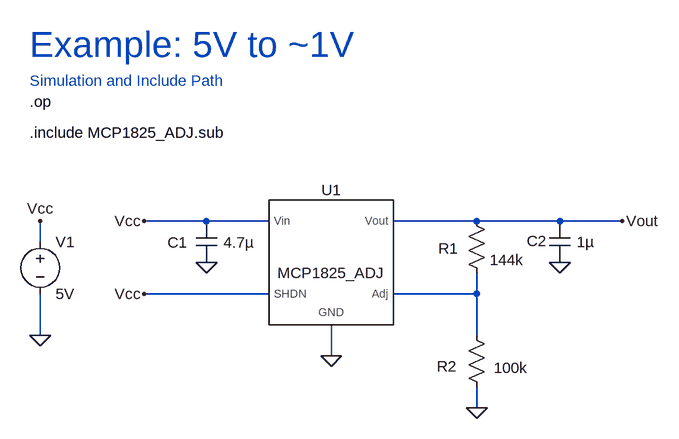
[diagram p0: schematic MCP1825_ADJ.asc]
MCP1825_ADJ.asc, the LTspice schematic file:
Version 4
SHEET 1 880 680
WIRE 48 64 -48 64
WIRE 144 64 48 64
WIRE 464 64 336 64
WIRE 592 64 464 64
WIRE 688 64 592 64
WIRE -208 96 -208 64
WIRE 144 176 -48 176
WIRE 464 176 464 144
WIRE 464 176 336 176
WIRE -208 240 -208 176
WIRE 464 240 464 176
WIRE 240 272 240 224
WIRE 464 352 464 320
FLAG -208 240 0
FLAG -208 64 Vcc
FLAG -48 64 Vcc
FLAG 48 128 0
FLAG -48 176 Vcc
FLAG 240 272 0
FLAG 464 352 0
FLAG 592 128 0
FLAG 688 64 Vout
SYMBOL PowerProducts\\MCP1825 240 176 R0
SYMATTR InstName U1
SYMBOL voltage -208 80 R0
SYMATTR InstName V1
SYMATTR Value 5V
SYMBOL cap 32 64 R0
WINDOW 0 -44 33 Left 2
WINDOW 3 42 33 Left 2
SYMATTR InstName C1
SYMATTR Value 4.7µ
SYMBOL res 448 224 R0
WINDOW 0 -45 64 Left 2
WINDOW 3 42 66 Left 2
SYMATTR InstName R2
SYMATTR Value 100k
SYMBOL res 448 48 R0
WINDOW 0 -43 58 Left 2
SYMATTR InstName R1
SYMATTR Value 144k
SYMBOL cap 576 64 R0
WINDOW 0 -35 31 Left 2
WINDOW 3 42 32 Left 2
SYMATTR InstName C2
SYMATTR Value 1µ
TEXT -224 -120 Left 2 !.op
TEXT -224 -72 Left 2 !.include MCP1825_ADJ.sub
TEXT -224 -208 Left 5 ;Example: 5V to ~1V
TEXT -224 -152 Left 2 ;Simulation and Include Path

The netlist it stands for:
* MCP1825_ADJ.asc
XU1 Vcc Vcc 0 Vout N001 MCP1825_ADJ MCP1825_ADJ  ; pins SHDN Vin GND Vout Adj
V1 Vcc 0 5V
C1 Vcc 0 4.7µ
R2 N001 0 100k
R1 Vout N001 144k
C2 Vout 0 1µ
.op
.include MCP1825_ADJ.sub
* Example: 5V to ~1V
* Simulation and Include Path
.backanno
.end